# Altium schematic sheet Sheet1.SchDoc
size A4
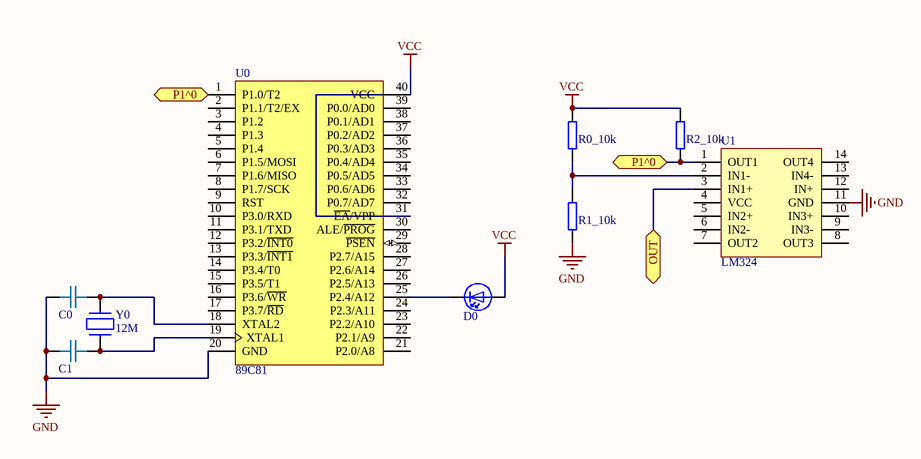
[diagram p0: Sheet1.SchDoc]

## Parts
C0  22pf  [capacitor-0.1]  (value not drawn)
C1  C_1  [capacitor-0.1]  (value not drawn)
D0  LED  [led-3]  (value not drawn)
R0_10k  RESIS  [resistor-0.4]  (value not drawn)
R1_10k  RESIS  [resistor-0.4]  (value not drawn)
R2_10k  RESIS  [resistor-0.4]  (value not drawn)
U0  89C81  [STC12C5A08S2]
U1  LM324  [DIP14]
Y0  XTAL  [Axial 0.2]  (value not drawn)

## Ports
OUT, P1^0

## Nets
GND: C0.1 C1.1 R1_10k.1 U0.20(GND) U1.11(GND)
VCC: D0.1 R0_10k.2 R2_10k.2 U0.40(VCC)
OUT: U1.3(IN1+) ; port OUT
P1^0: R2_10k.1 U0.1(P1.0/T2) U1.1(OUT1) ; port P1^0
NetC0_2: C0.2 U0.18(XTAL2) Y0.2
NetC1_2: C1.2 U0.19(XTAL1) Y0.1
NetD0_2: D0.2 U0.25(P2.4/A12)
NetR0_10k_1: R0_10k.1 R1_10k.2 U1.2(IN1-)

Not connected (* = marked no-connect by the designer): U0 2(P1.1/T2/EX) 3(P1.2) 4(P1.3) 5(P1.4) 6(P1.5/MOSI) 7(P1.6/MISO) 8(P1.7/SCK) 9(RST) 10(P3.0/RXD) 11(P3.1/TXD) 12(P3.2/~{INT0}) 13(P3.3/~{INT1}) 14(P3.4/T0) 15(P3.5/T1) 16(P3.6/~{WR}) 17(P3.7/~{RD}) 21(P2.0/A8) 22(P2.1/A9) 23(P2.2/A10) 24(P2.3/A11) 26(P2.5/A13) 27(P2.6/A14) 28(P2.7/A15) 29(~{PSEN}) 30(ALE/~{PROG}) 31(~{EA}/VPP) 32(P0.7/AD7) 33(P0.6/AD6) 34(P0.5/AD5) 35(P0.4/AD4) 36(P0.3/AD3) 37(P0.2/AD2) 38(P0.1/AD1) 39(P0.0/AD0); U1 4(VCC) 5(IN2+) 6(IN2-) 7(OUT2) 8(OUT3) 9(IN3-) 10(IN3+) 12(IN+) 13(IN4-) 14(OUT4)

## Notes on the sheet
- (in symbol XTAL) 12M

## Library data of the parts
C0 = C_1
D0 = LED-30
U0 = STC12C5A08S2